# Altium schematic sheet Hardware Achitecture.SchDoc
size A3; Date: 27.05.2014; DrawnBy: luths8; Organization: BFH; Address1: Bern University of Applied Sciences; Address2: Engineering and Information Technology; Address3: Jlcoweg 1; Address4: CH-3400 Burgdorf; DocumentNumber: 1; Revision: 1.1; SheetNumber: 1; SheetTotal: 3; CurrentDate: 27.05.2014
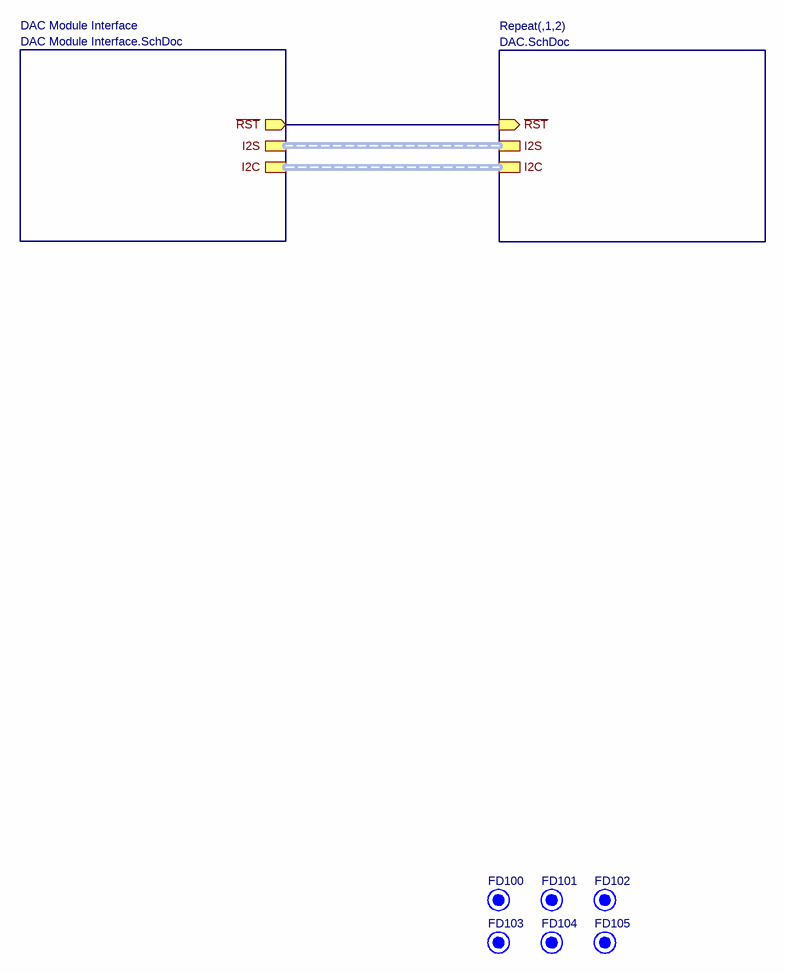
[diagram p0: Hardware Achitecture.SchDoc]

## Parts
FD100  Fiducial  [FIDUCIAL]  (value not drawn)  (no BOM)
FD101  Fiducial  [FIDUCIAL]  (value not drawn)  (no BOM)
FD102  Fiducial  [FIDUCIAL]  (value not drawn)  (no BOM)
FD103  Fiducial  [FIDUCIAL]  (value not drawn)  (no BOM)
FD104  Fiducial  [FIDUCIAL]  (value not drawn)  (no BOM)
FD105  Fiducial  [FIDUCIAL]  (value not drawn)  (no BOM)

## Sub-sheets
DAC Module Interface = DAC Module Interface.SchDoc: ~{RST} (out), I2S (harness I2S), I2C (harness I2C)
Repeat(,1,2) = DAC.SchDoc: ~{RST} (in), I2S (harness I2S), I2C (harness I2C)

## Nets
(unnamed): sheet Repeat(,1,2)/~{RST}, sheet DAC Module Interface/~{RST}

## Buses and harness runs
harness sheet DAC Module Interface/I2C = sheet Repeat(,1,2)/I2C
harness sheet DAC Module Interface/I2S = sheet Repeat(,1,2)/I2S

## Notes on the sheet
- Project:
- Size:
- Sheet:
- Title:
- A3
- of
- Drawn by:
- Revision:
- Date:
- Variant:
- b
- File:

## Library data of the parts
FD100-FD105 = Fiducial: Fiducial Marker